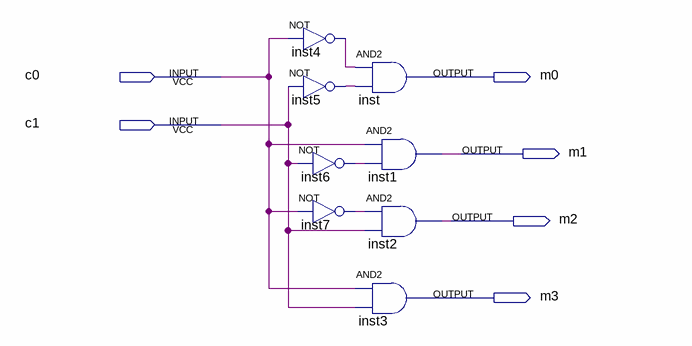
[diagram p0: schematic sheet]
// Quartus schematic demultiplexer_0.bdf as structural Verilog: 8 symbols, 6 pins
module demultiplexer_0 (
  input  c0,
  input  c1,
  output m0,
  output m1,
  output m2,
  output m3
);

  wire inst4_out, inst5_out, inst6_out, inst7_out;

  not inst4 (inst4_out, c0);
  not inst5 (inst5_out, c1);
  not inst6 (inst6_out, c1);
  not inst7 (inst7_out, c0);
  and inst (m0, inst4_out, inst5_out);
  and inst1 (m1, c0, inst6_out);
  and inst2 (m2, inst7_out, c1);
  and inst3 (m3, c0, c1);
endmodule
